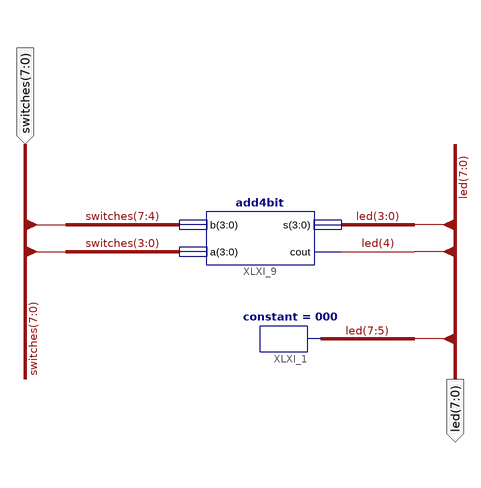
[diagram p0: schematic sheet 1]
// Xilinx ISE schematic toplevel.sch (spartan3e) as structural Verilog: 2 symbols, 2 ports
module toplevel (
  input  [7:0] switches,
  output [7:0] led
);

  constant #(.CValue("000")) XLXI_1 (.O(led[7:5]));
  add4bit XLXI_9 (.b(switches[7:4]), .a(switches[3:0]), .s(led[3:0]), .cout(led[4]));
endmodule
